# EAGLE design PiBladePsuInput (EAGLE 7.4.0)
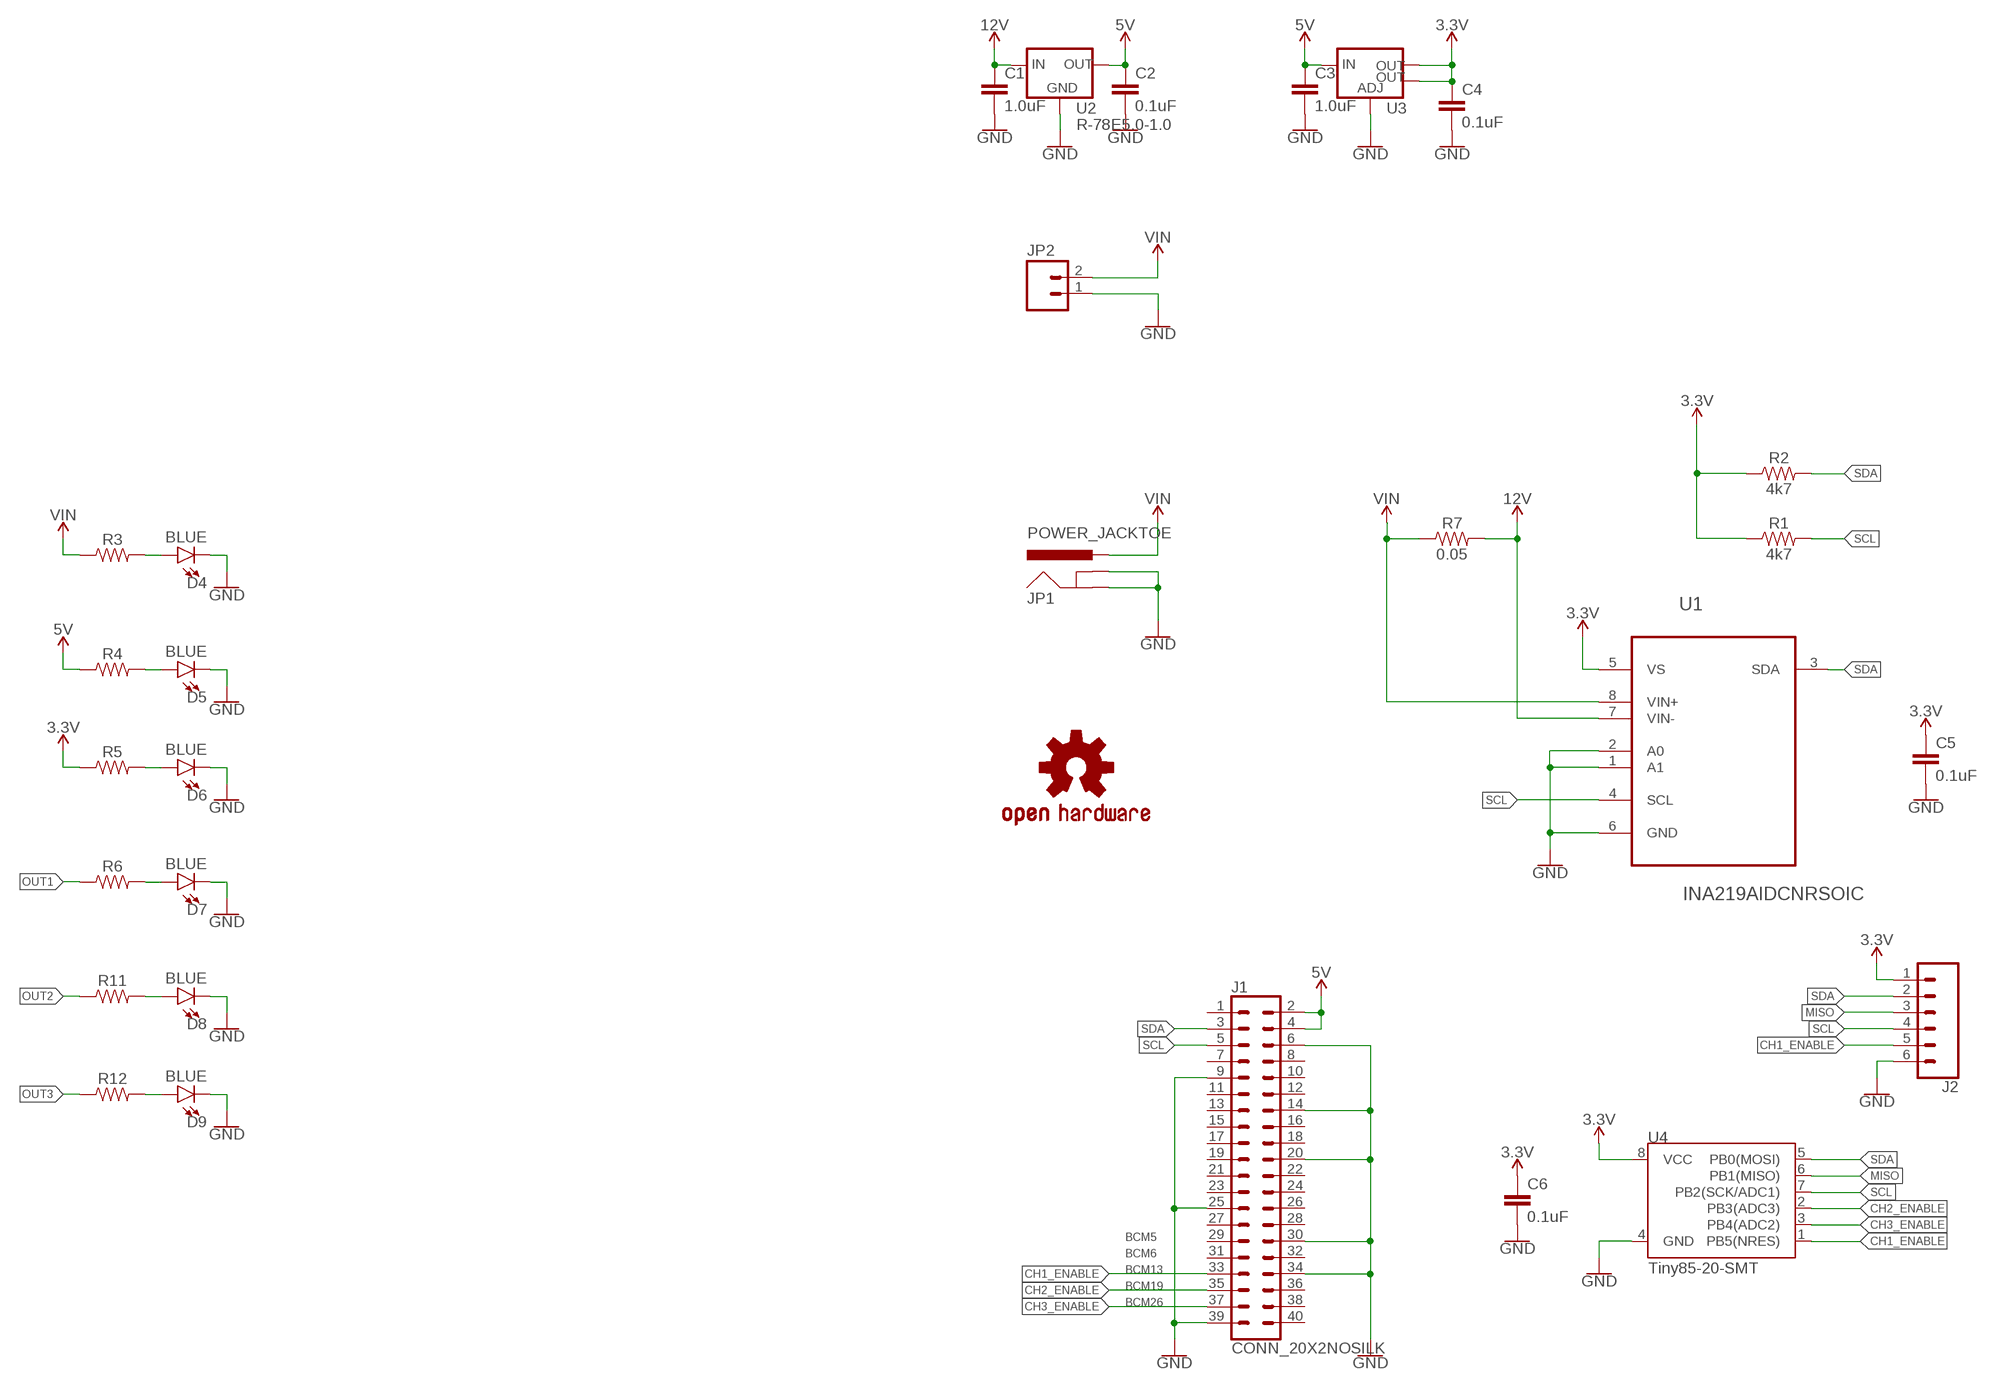
[diagram p0: schematic, sheet 1, part 1 of 2]
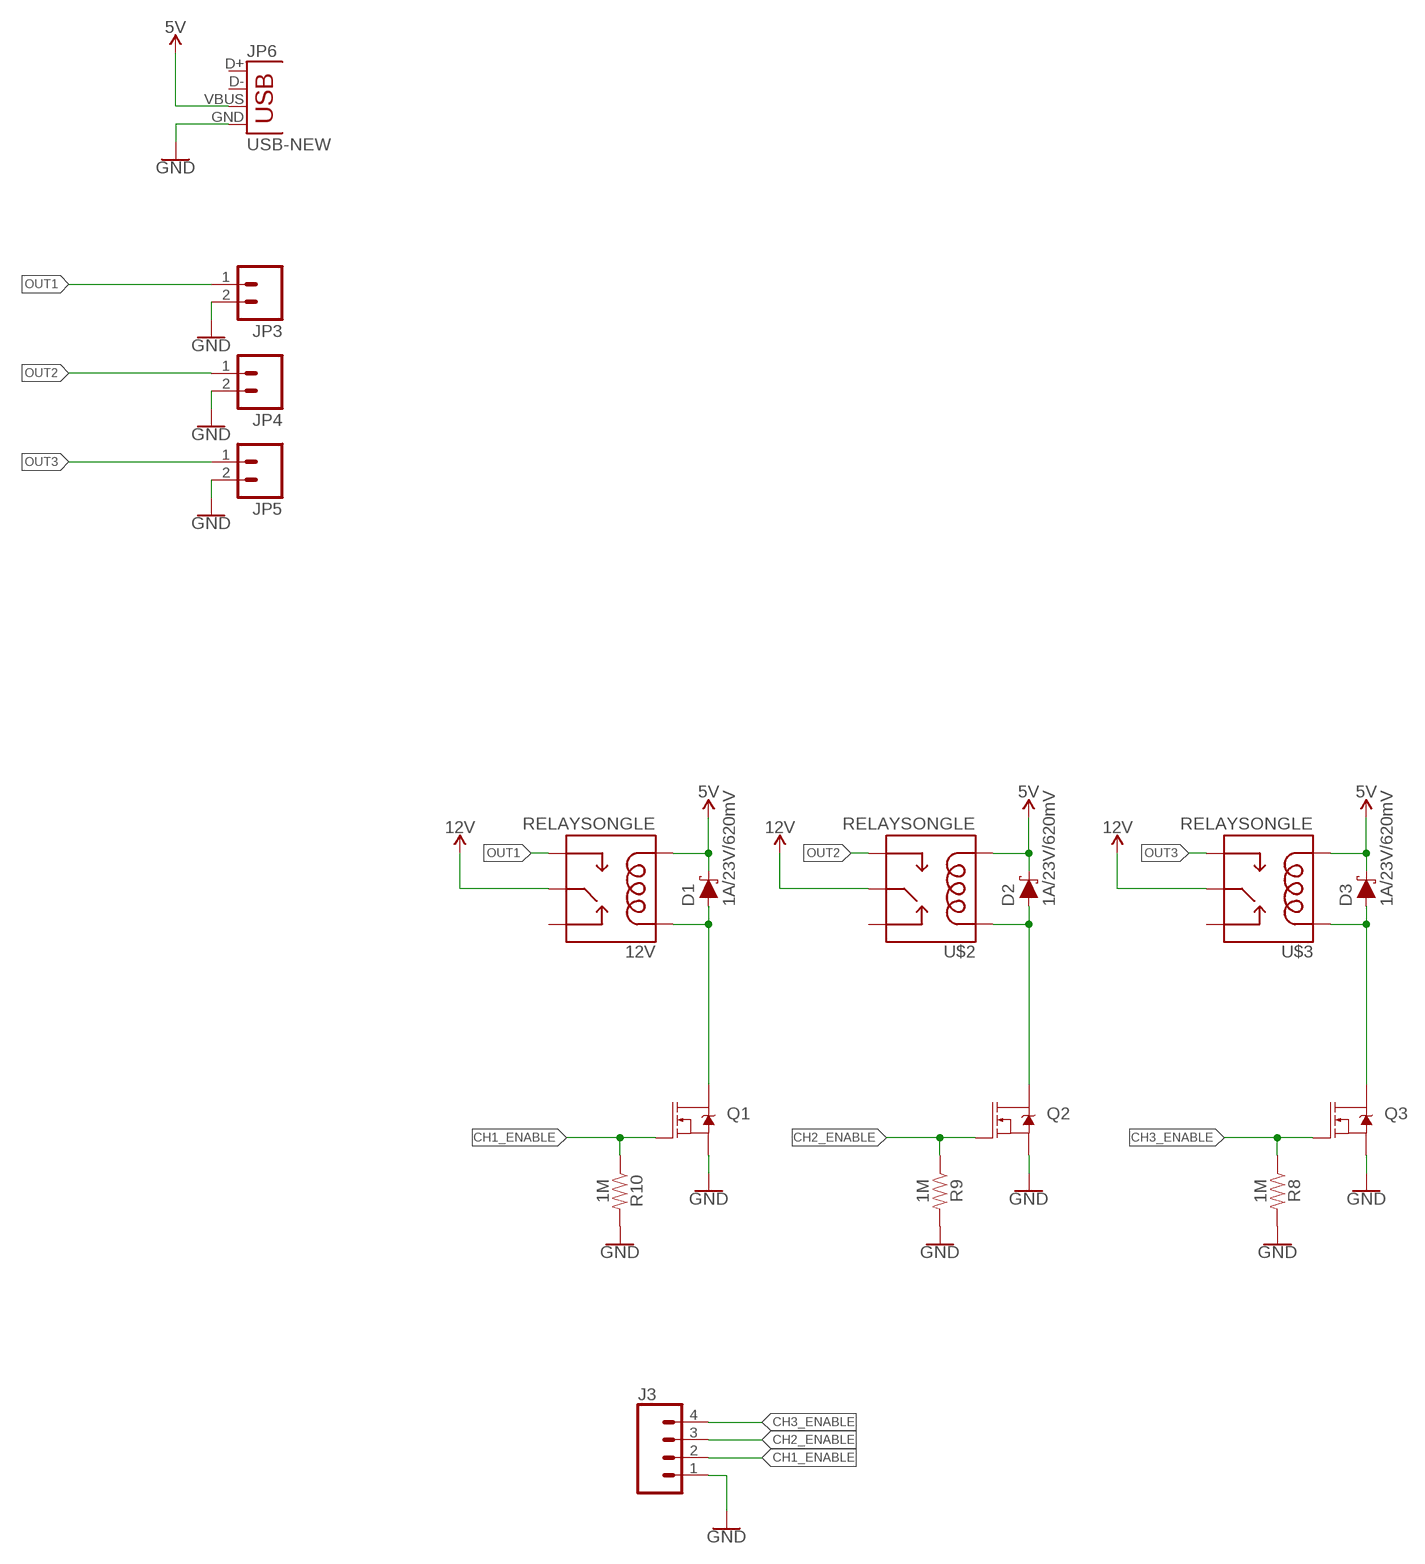
[diagram p1: schematic, sheet 1, part 2 of 2]

## Parts
12V  RELAYSONGLE  [SRD-5VDC-SL-C]
C1  1.0uF  1.0UF-0805-25V-(+80/-20%)  [0805]
C2  0.1uF  1.0UF-0805-25V-(+80/-20%)  [0805]
C3  1.0uF  1.0UF-0805-25V-(+80/-20%)  [0805]
C4  0.1uF  1.0UF-0805-25V-(+80/-20%)  [0805]
C5  0.1uF  1.0UF-0805-25V-(+80/-20%)  [0805]
C6  0.1uF  1.0UF-0805-25V-(+80/-20%)  [0805]
D1  1A/23V/620mV  DIODE-SCHOTTKY-BAT20J  [SOD-323]
D2  1A/23V/620mV  DIODE-SCHOTTKY-BAT20J  [SOD-323]
D3  1A/23V/620mV  DIODE-SCHOTTKY-BAT20J  [SOD-323]
D4  BLUE  LED-BLUE1206  [LED-1206]
D5  BLUE  LED-BLUE1206  [LED-1206]
D6  BLUE  LED-BLUE1206  [LED-1206]
D7  BLUE  LED-BLUE1206  [LED-1206]
D8  BLUE  LED-BLUE1206  [LED-1206]
D9  BLUE  LED-BLUE1206  [LED-1206]
J1  CONN_20X2NOSILK  [2X20_NOSILK]
J2  CONN_06SMD-1MM  [1X06-1MM]
J3  CONN_04SMD2  [1X04_1MM_RA]
JP1  POWER_JACKTOE  [POWER_JACK_SMD_OVERPASTE_TOE]
JP2  M025MM  [SCREWTERMINAL-5MM-2]
JP3  M025MM  [SCREWTERMINAL-5MM-2]
JP4  M025MM  [SCREWTERMINAL-5MM-2]
JP5  M025MM  [SCREWTERMINAL-5MM-2]
JP6  USB-NEW  [USB-A-VERTICAL]
LOGO1  OSHW-LOGOM  [OSHW-LOGO-M]
Q1  220mA/50V/3.5Ω  MOSFET-NCH-BSS138  [SOT23-3]
Q2  220mA/50V/3.5Ω  MOSFET-NCH-BSS138  [SOT23-3]
Q3  220mA/50V/3.5Ω  MOSFET-NCH-BSS138  [SOT23-3]
R1  4k7  RESISTOR0805  [0805]
R2  4k7  RESISTOR0805  [0805]
R3  RESISTOR0805  [0805]
R4  RESISTOR0805  [0805]
R5  RESISTOR0805  [0805]
R6  RESISTOR0805  [0805]
R7  0.05  0.05OHM-2512-3W-1%  [2512]
R8  1M  RESISTOR0805  [0805]
R9  1M  RESISTOR0805  [0805]
R10  1M  RESISTOR0805  [0805]
R11  RESISTOR0805  [0805]
R12  RESISTOR0805  [0805]
U1  INA219AIDCNRSOIC  [SO08]
U2  R-78E5.0-1.0  [DC-DC_CONVERTER_78XX]
U3  V_REG_LM1117SOT223  [SOT223]
U4  Tiny85-20-SMT  ATTINY45TINY85-20-SMT  [SO08-EIAJ]
U$2  RELAYSONGLE  [SRD-5VDC-SL-C]
U$3  RELAYSONGLE  [SRD-5VDC-SL-C]

## Nets
3.3V: C4.1 C5.1 C6.1 J2.1 R1.1 R2.1 R5.1 U1.5(VS) U3.2(OUT) U3.4(OUT) U4.8(VCC)
5V: 12V.COIL2 C2.1 C3.1 D1.C D2.C D3.C J1.2 J1.4 JP6.VBUS R4.1 U2.VOUT(OUT) U3.3(IN) U$2.COIL2 U$3.COIL2
12V: 12V.COMMON(MAIN) C1.1 R7.P$2 U1.7(VIN-) U2.VIN(IN) U$2.COMMON(MAIN) U$3.COMMON(MAIN)
CH1_ENABLE: J1.33 J2.5 J3.2 Q1.1(G) R10.1 U4.1(PB5(NRES))
CH2_ENABLE: J1.35 J3.3 Q2.1(G) R9.1 U4.2(PB3(ADC3))
CH3_ENABLE: J1.37 J3.4 Q3.1(G) R8.1 U4.3(PB4(ADC2))
GND: C1.2 C2.2 C3.2 C4.2 C5.2 C6.2 D4.C D5.C D6.C D7.C D8.C D9.C J1.6 J1.9 J1.14 J1.20 J1.25 J1.30 J1.34 J1.39 J2.6 J3.1 JP1.GND(GNDBREAK) JP1.P$4(GND) JP2.1 JP3.2 JP4.2 JP5.2 JP6.GND Q1.2(S) Q2.2(S) Q3.2(S) R8.2 R9.2 R10.2 U1.1(A1) U1.2(A0) U1.6(GND) U2.GND U3.1(ADJ) U4.4(GND)
MISO: J2.3 U4.6(PB1(MISO))
N$1: D4.A R3.2
N$2: D6.A R5.2
N$3: D7.A R6.2
N$4: D5.A R4.2
N$5: D8.A R11.2
N$6: D9.A R12.2
N$14: D3.A Q3.3(D) U$3.COIL1
N$31: D2.A Q2.3(D) U$2.COIL1
N$32: 12V.COIL1 D1.A Q1.3(D)
OUT1: 12V.OPEN(NO) JP3.1 R6.1
OUT2: JP4.1 R11.1 U$2.OPEN(NO)
OUT3: JP5.1 R12.1 U$3.OPEN(NO)
SCL: J1.5 J2.4 R1.2 U1.4(SCL) U4.7(PB2(SCK/ADC1))
SDA: J1.3 J2.2 R2.2 U1.3(SDA) U4.5(PB0(MOSI))
VIN: JP1.VIN0(PWR) JP2.2 R3.1 R7.P$1 U1.8(VIN+)
Unconnected: 12V.CLOSED(NC) J1.1 J1.7 J1.8 J1.10 J1.11 J1.12 J1.13 J1.15 J1.16 J1.17 J1.18 J1.19 J1.21 J1.22 J1.23 J1.24 J1.26 J1.27 J1.28 J1.29 J1.31 J1.32 J1.36 J1.38 J1.40 JP6.D+ JP6.D- U$2.CLOSED(NC) U$3.CLOSED(NC)

## Notes on the sheet
- BCM5
- BCM6
- BCM13
- BCM19
- BCM26

## Library data of the parts
12V U$2 U$3 = ThingySticks:RELAY: SPDT relay (COM-00101)
C1 C3 = SparkFun-Capacitors:1.0UF: 1µF ceramic capacitors A capacitor is a passive two-terminal electrical component used to store electrical energy temporarily in an electric field.; PROD_ID: CAP-11625
C2 C4-C6 = SparkFun-Capacitors:1.0UF: 1µF ceramic capacitors A capacitor is a passive two-terminal electrical component used to store electrical energy temporarily in an electric field.; PROD_ID: CAP-11625; VALUE: 1.0uF
D1-D3 = SparkFun-DiscreteSemi:DIODE-SCHOTTKY: Schottky diode A Schottky diode is a semiconductor diode which has a low forward voltage drop and a very fast switching action.; PROD_ID: DIO-11623
D4-D9 = SparkFun-LED:LED-BLUE: Blue SMD LED Used in manufacturing of various products at SparkFun Packages: 0603 - SMD 0603 package [Product Link] <http://www.digikey.com/product-detail/en/SMLE12BC7TT86/511-1589-2-ND/1641808> 1206 - SMD1206 package [Product Link] <http://www.digikey.com/product-detail/en/lite-on-inc/LTST-C150TBKT/160-1643-1-ND/573584> SparkFun Products: ESP8266 Thing-Dev Board <https://www.sparkfun.com/products/13711> RedBoard <https://www.sparkfun.com/products/12757>; PROD_ID: DIO-09911
J1 = SparkFun-Connectors:CONN_20X2: Multi connection point. Often used as Generic Header-pin footprint for 0.1 inch spaced/style header connections On any of the 0.1 inch spaced packages, you can populate with these: Break Away Headers - Straight <https://www.sparkfun.com/products/116> (PRT-00116) Break Away Male Headers - Right Angle <https://www.sparkfun.com/products/553> (PRT-00553) Female Headers <https://www.sparkfun.com/products/115> (PRT-00115) Break Away Headers - Machine Pin <https://www.sparkfun.com/products/117> (PRT-00117) Break Away Female Headers - Swiss Machine Pin <https://www.sparkfun.com/products/743> (PRT-00743)
J2 = SparkFun-Connectors:CONN_06: Multi connection point. Often used as Generic Header-pin footprint for 0.1 inch spaced/style header connections On any of the 0.1 inch spaced packages, you can populate with these: Break Away Headers - Straight <https://www.sparkfun.com/products/116> (PRT-00116) Break Away Male Headers - Right Angle <https://www.sparkfun.com/products/553> (PRT-00553) Female Headers <https://www.sparkfun.com/products/115> (PRT-00115) Break Away Headers - Machine Pin <https://www.sparkfun.com/products/117> (PRT-00117) Break Away Female Headers - Swiss Machine Pin <https://www.sparkfun.com/products/743> (PRT-00743) Arduino Stackable Header - 6 Pin <https://www.sparkfun.com/products/9280> (PRT-09280) For SCREWTERMINALS and SPRING TERMINALS visit here: Screw Terimnals on SparkFun.com <https://www.sparkfun.com/search/results?term=Screw+Terminals> (5mm/3.5mm/2.54mm spacing) This device is also useful as a general connection point to wire up your design to another part of your project. Our various solder wires solder well into these plated through hole pads. Hook-Up Wire - Assortment (Stranded, 22 AWG) <https://www.sparkfun.com/products/11375> (PRT-11375) Hook-Up Wire - Assortment (Solid Core, 22 AWG) <https://www.sparkfun.com/products/11367> (PRT-11367) View the entire wire category on our website here <https://www.sparkfun.com/categories/141>; PROD_ID: CONN-08249; SF_ID: GPS-00579
J3 = SparkFun-Connectors:CONN_04: Multi connection point. Often used as Generic Header-pin footprint for 0.1 inch spaced/style header connections On any of the 0.1 inch spaced packages, you can populate with these: Break Away Headers - Straight <https://www.sparkfun.com/products/116> (PRT-00116) Break Away Male Headers - Right Angle <https://www.sparkfun.com/products/553> (PRT-00553) Female Headers <https://www.sparkfun.com/products/115> (PRT-00115) Break Away Headers - Machine Pin <https://www.sparkfun.com/products/117> (PRT-00117) Break Away Female Headers - Swiss Machine Pin <https://www.sparkfun.com/products/743> (PRT-00743) For SCREWTERMINALS and SPRING TERMINALS visit here: Screw Terimnals on SparkFun.com <https://www.sparkfun.com/search/results?term=Screw+Terminals> (5mm/3.5mm/2.54mm spacing) This device is also useful as a general connection point to wire up your design to another part of your project. Our various solder wires solder well into these plated through hole pads. Hook-Up Wire - Assortment (Stranded, 22 AWG) <https://www.sparkfun.com/products/11375> (PRT-11375) Hook-Up Wire - Assortment (Solid Core, 22 AWG) <https://www.sparkfun.com/products/11367> (PRT-11367) View the entire wire category on our website here <https://www.sparkfun.com/categories/141> Special notes: Molex polarized connector foot print use with SKU : PRT-08231 with associated crimp pins and housings. 1MM SMD Version SKU: PRT-10208; PROD_ID: CONN-10310; SF_ID: PRT-10208
JP1 = SparkFun-Connectors:POWER_JACK: Power Jack Connector This is the standard 5.5mm barrel jack for power. The PTH is the most common, proven, reliable, footprint. The Slot footprint only works if the mill layer is transmitted to the PCB fab house so be warned. Here are the connectors we sell at SparkFun: DC Barrel Power Jack/Connector <https://www.sparkfun.com/products/119> (PRT-00119) DC Barrel Power Jack/Connector (SMD) <https://www.sparkfun.com/products/12748> (PRT-12748) DC Barrel Jack Adapter - Breadboard Compatible <https://www.sparkfun.com/products/10811> (PRT-10811) It is used on this SparkFun product (and many, many others): SparkFun RedBoard - Programmed with Arduino <https://www.sparkfun.com/products/12757> (DEV-12757) Also, if you need a mating power supply or connector, please check these out: Wall Adapter Power Supply - 9VDC 650mA <https://www.sparkfun.com/products/298> (TOL-00298) DC Barrel Jack Adapter - Male <https://www.sparkfun.com/products/10287> (PRT-10287); PROD_ID: CONN-08106; SF_ID: PRT-12748
JP2-JP5 = SparkFun-Connectors:M02: Standard 2-pin 0.1" header. Use with - straight break away headers ( PRT-00116) - right angle break away headers (PRT-00553) - swiss pins (PRT-00743) - machine pins (PRT-00117) - female headers (PRT-00115) Molex polarized connector foot print use with: PRT-08233 with associated crimp pins and housings. 2.54_SCREWTERM for use with PRT-10571. 3.5mm Screw Terminal footprints for PRT-08084 5mm Screw Terminal footprints for use with PRT-08432; STOREFRONT_ID: PRT-08432
JP6 = Tinamous:USB-NEW: USB Connectors USB-B-PTH is fully proven SKU : PRT-00139/CONN-08278 USB-miniB is fully proven SKU : PRT-00587 USB-A-PCB is untested. USB-A-H is throughly reviewed, but untested. Spark Fun Electronics SKU : PRT-00437 USB-B-SMT is throughly reviewed, but untested. Needs silkscreen touching up. USB-A-S has not been used/tested USB-MB-H has not been used/tested USB-MICROB has been used. CONN-09505
LOGO1 = Tinamous:OSHW-LOGO: Open Source Hardware Logo This logo indicates the piece of hardware it is found on incorporates a OSHW license and/or adheres to the definition of open source hardware found here: http://freedomdefined.org/OSHW
Q1-Q3 = SparkFun-DiscreteSemi:MOSFET-NCH: N-channel MOSFETs Voltage controlled devices that allow control of high current outputs. SparkFun Products: SparkFun OpenScale <https://www.sparkfun.com/products/13261> SparkFun Digital Sandbox <https://www.sparkfun.com/products/12651> SparkFun Monster Moto Shield <https://www.sparkfun.com/products/10182> SparkFun MOSFET Power Controller <https://www.sparkfun.com/products/11214>; PROD_ID: TRANS-00830
R1-R6 R8-R12 = SparkFun-Resistors:RESISTOR: Generic Resistor Package
R7 = SparkFun-Resistors:0.05OHM: 0.05Ω resistor A resistor is a passive two-terminal electrical component that implements electrical resistance as a circuit element. Resistors act to reduce current flow, and, at the same time, act to lower voltage levels within circuits. - Wikipedia; PROD_ID: RES-13771
U1 = INA219AIDCNR:INA219AIDCNR: CURRENT/POWER MONITOR
U2 = SparkFun-IC-Power:R-78E5.0-1.0: Recom Power 5V 1A DC/DC Converter The Recom R-78E5.0-X.X is a compact DC/DC converter module that is a pin for pin drop-in replacement for the LM7805 linear voltage regulator. Specifications: Input Range: 7-28V Output Voltage: 5V Output Current: 1A Max Efficiency: 91% Datasheet <https://www.recom-power.com/pdf/Innoline/R-78Exx-1.0.pdf>; PROD_ID: COM-13655
U3 = SparkFun-PowerIC:V_REG_LM1117: Voltage Regulator LM1117 Standard adjustable voltage regulator but in SMD form. Spark Fun Electronics SKU : COM-00595; PROD_ID: VREG-08170
U4 = SparkFun-DigitalIC:ATTINY45: Atmel 8-pin 2/4/8kB flash uC; PROD_ID: IC-09092

## Board
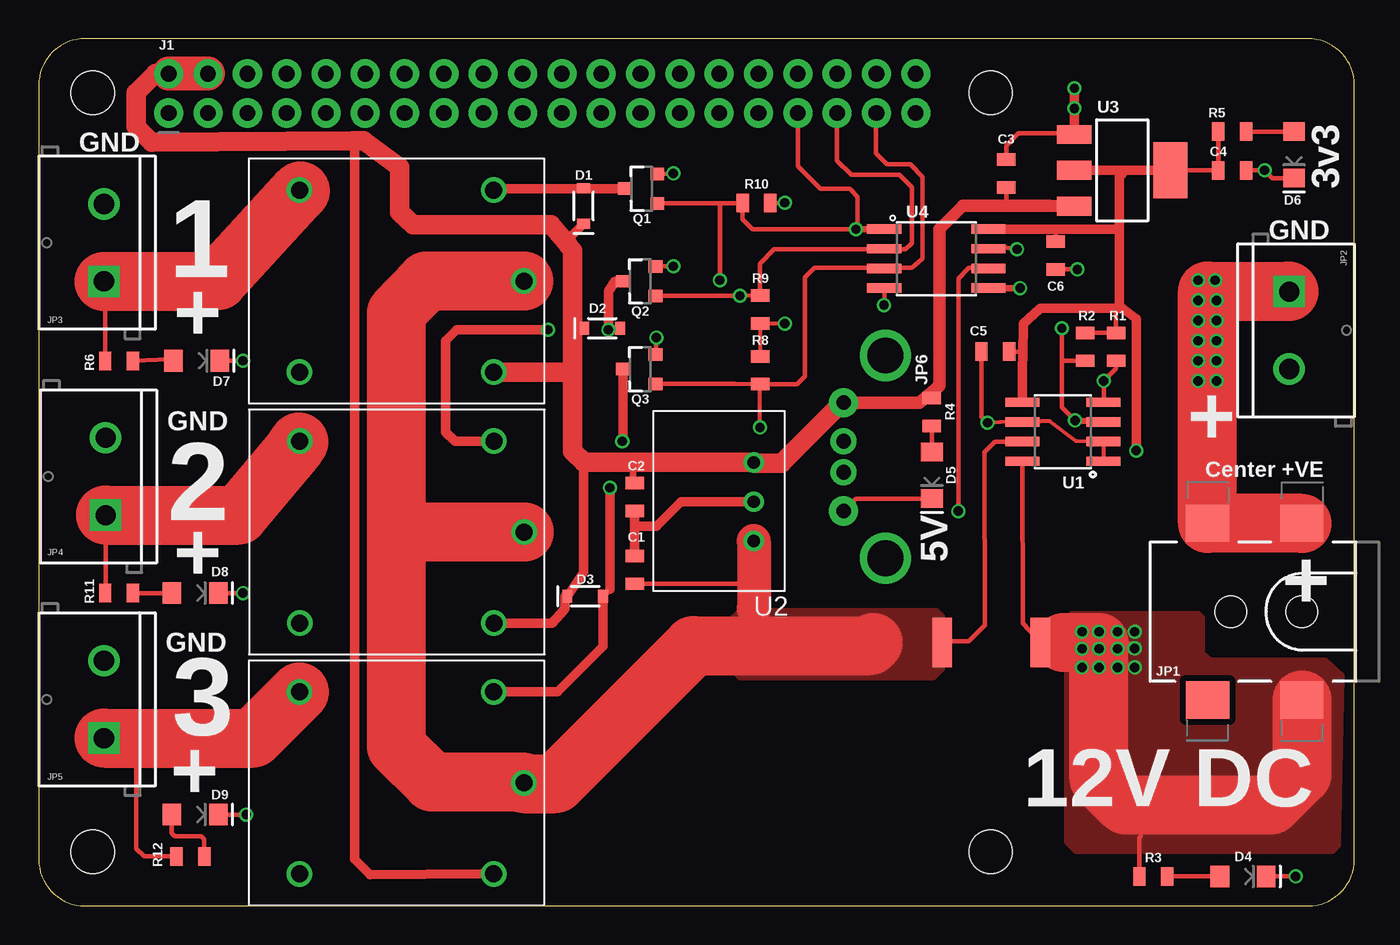
[diagram p2: board, top side]
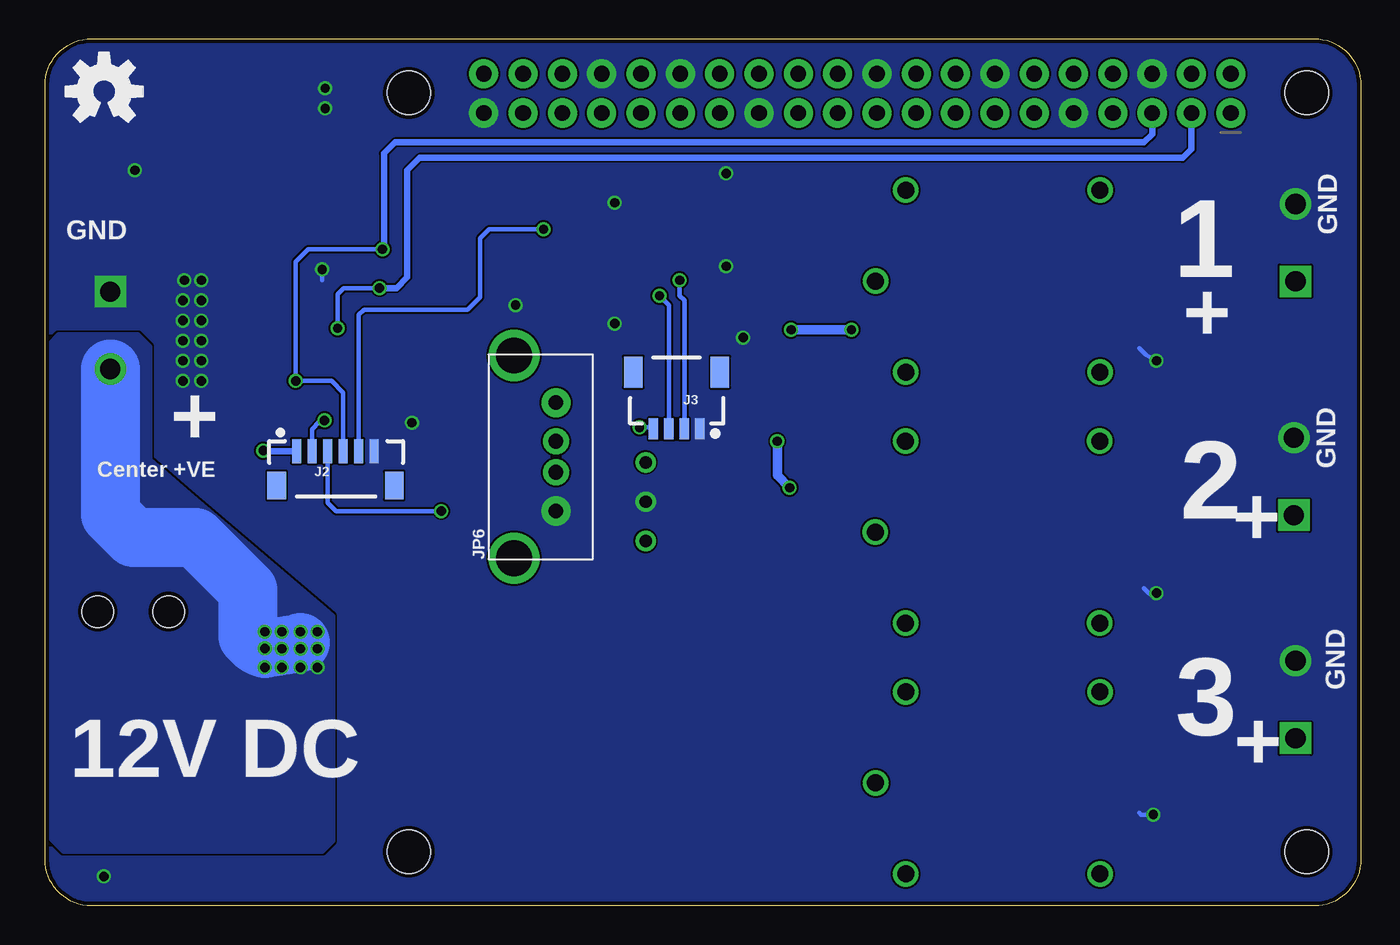
[diagram p3: board, bottom side, seen from below]

Size 85 x 56 mm. Coordinates in mm from the lower left corner, seen from the top.
Outline: 0,3 arc90 3,0 82,0 arc90 85,3 85,53 arc90 82,56 3,56 arc90 0,53 0,3
Copper layers (1*16): Top 0.035mm / dielectric 1.5mm / Bottom 0.035mm
Design rules "dirt_cheap_dirty_boards.v1": minimum track width 5mil, minimum drill 12mil, track to track 5mil, track to pad 5mil, pad to pad 5mil, via to via 5mil, smd to smd 0mil, copper to edge 10mil, drill to drill 10mil, minimum pad ring 10mil, minimum via ring 6mil, stop-mask expansion 2mil, vias tented up to drill 25mil, thermal gap 10mil
Holes 2.8 mm at 3.5,52.5 61.5,52.5 3.5,3.5 61.5,3.5

### Footprints (pad centres in the part's own frame; a part is rotated, then mirrored left to right if it is on the bottom)
SRD-5VDC-SL-C = drill 1.1: CLOSED -6.275,-5.875; COIL1 6.275,5.875; COIL2 6.275,-5.875; COMMON 8.225,0; OPEN -6.275,5.875
0805 = smd 0.8 x 1.2: 1 -0.9,0; 2 0.9,0
SOD-323 = smd 0.63 x 0.83: A 1.15,0; C -1.15,0
LED-1206 = smd 1.2 x 1.4: A -1.5,0; C 1.5,0
2X20_NOSILK = drill 1.016 pad 1.88: 1 0,0; 2 0,2.54; 3 2.54,0; 4 2.54,2.54; 5 5.08,0; 6 5.08,2.54; 7 7.62,0; 8 7.62,2.54; 9 10.16,0; 10 10.16,2.54; 11 12.7,0; 12 12.7,2.54; 13 15.24,0; 14 15.24,2.54; 15 17.78,0; 16 17.78,2.54; 17 20.32,0; 18 20.32,2.54; 19 22.86,0; 20 22.86,2.54; 21 25.4,0; 22 25.4,2.54; 23 27.94,0; 24 27.94,2.54; 25 30.48,0; 26 30.48,2.54; 27 33.02,0; 28 33.02,2.54; 29 35.56,0; 30 35.56,2.54; 31 38.1,0; 32 38.1,2.54; 33 40.64,0; 34 40.64,2.54; 35 43.18,0; 36 43.18,2.54; 37 45.72,0; 38 45.72,2.54; 39 48.26,0; 40 48.26,2.54
1X06-1MM = smd 0.6 x 1.55: 1 -2.54,1.27; 2 -1.54,1.27; 3 -0.54,1.27; 4 0.46,1.27; 5 1.46,1.27; 6 2.46,1.27 | smd 1.2 x 1.8: P$1 -3.84,-0.955; P$2 3.76,-0.955
1X04_1MM_RA = smd 0.6 x 1.35: 1 -1.5,0; 2 -0.5,0; 3 0.5,0; 4 1.5,0 | smd 1.2 x 2: NC1 2.8,-3.675; NC2 -2.8,-3.675
POWER_JACK_SMD_OVERPASTE_TOE = smd 2.8 x 2.4: GND 0,-5.7; P$4 6.1,-5.7; VIN0 0,5.7; VIN1 6.1,5.7 | hole 2.032: 0,0; 4.572,0
SCREWTERMINAL-5MM-2 = drill 1.3 pad 2.032 square: 1 0,0 | drill 1.3 pad 2.032: 2 5,0
USB-A-VERTICAL = drill 0.95 pad 1.676: D+ 2.7,1; D- 2.7,-1 | drill 0.95 pad 1.88: GND 2.7,3.5; VBUS 2.7,-3.5 | drill 2.3: SHLD1 0,-6.55; SHLD2 0,6.55
SOT23-3 = smd 0.8 x 0.9: 1 -0.95,-1; 2 0.95,-1; 3 0,1.1
2512 = smd 1.27 x 3.175: P$1 -3.175,0; P$2 3.175,0
SO08 = smd 0.61 x 2.21: 1 -1.905,-2.616; 2 -0.635,-2.616; 3 0.635,-2.616; 4 1.905,-2.616; 5 1.905,2.616; 6 0.635,2.616; 7 -0.635,2.616; 8 -1.905,2.616
DC-DC_CONVERTER_78XX = drill 0.8: GND 0,0; VIN -2.54,0; VOUT 2.54,0
SOT223 = smd 1.219 x 2.235: 1 -2.311,-3.099; 2 0,-3.099; 3 2.311,-3.099 | smd 3.6 x 2.2: 4 0,3.099
SO08-EIAJ = smd 0.61 x 2.21: 1 -1.905,-3.378; 2 -0.635,-3.378; 3 0.635,-3.378; 4 1.905,-3.378; 5 1.905,3.353; 6 0.635,3.353; 7 -0.635,3.353; 8 -1.905,3.353

### Placement (x,y rotation side)
12V  23.12,40.35 0 top
C1  38.5,21.7 90 top
C2  38.5,26.4 270 top
C3  62.5,47.3 90 top
C4  77.1,47.5 0 top
C5  61.8,35.8 180 top
C6  65.7,42 270 top
D1  35.2,45.2 90 top
D2  36.4,37.3 0 top
D3  35.3,20 0 top
D4  77.8,1.9 0 top
D5  57.7,27.8 270 top
D6  81.1,48.5 270 top
D7  10.2,35.2 0 top
D8  10.1,20.2 0 top
D9  10.1,5.9 0 top
J1  8.4,51.2 0 top
J2  66.2,28.1 0 bottom
J3  44.2,30.8 180 bottom
JP1  81.6,19 180 top
JP2  80.78,39.67 270 top
JP3  4.22,40.33 90 top
JP4  4.32,25.23 90 top
JP5  4.22,10.83 90 top
JP6  54.7,29 180 top
LOGO1  81.18,52.6 0 top
Q1  38.96,46.32 90 top
Q2  38.86,40.34 90 top
Q3  38.86,34.66 90 top
R1  69.6,36.1 270 top
R2  67.6,36.1 270 top
R3  72,1.9 0 top
R4  57.7,31.9 270 top
R5  77.1,50 0 top
R6  5.2,35.2 0 top
R7  61.54,17.01 180 top
R8  46.6,34.59 90 top
R9  46.6,38.52 270 top
R10  46.37,45.4 0 top
R11  5.2,20.2 0 top
R12  9.8,3.2 0 top
U1  66.16,30.62 90 top
U2  46.2,26.1 90 top
U3  70,47.5 270 top
U4  58,41.8 270 top
U$2  23.14,24.14 0 top
U$3  23.12,7.94 0 top

### Tracks (layer width: path | path; a pad name or v marks a point on that pad's centre or on a via)
3.3V  (via drill 0.6)
  Top 0.305: U3.4 C4.1 R5.1 | C5.1 63.57,35.8 63.58,35.79 | C6.1 65.7,43.6 65.8,43.7 | R2.1 R1.1 69.6,38.4 69.8,38.6
  Top 0.61: U1.5 63.56,34.54 63.58,35.79 63.6,37.4 63.6,37.6 64.7,38.6 69.8,38.6 | 69.8,38.6 70,38.6 70.9,37.9 v70.9,29.4 | U4.8 65.8,43.7 68.69,43.7 69.8,43.7 | 69.8,38.6 69.8,43.7 | 69.8,43.7 69.8,47.1 70.2,47.5 | 70.2,47.5 U3.4 | U3.2 70.2,47.5
  Bottom 0.406: J2.1 70.87,29.37 v70.9,29.4
5V
  Top 0.254: 29.42,34.5 12V.COIL2
  Top 0.305: C3.1 62.5,45.2 | 34.45,43.3 34.2,42.7 | D2.C 34.6,37.3 34.5,37.2 | R4.1 57.64,32.8 57.47,32.98 | 20.4,49.3 20.3,49.4
  Top 0.406: D3.C 34,20 | 12V.COIL2 | C2.1 38.4,27.4 38.4,28.64
  Top 0.61: U$2.COIL2 33.16,18.27 34,19.2 34,20 | D1.C 34.45,43.3 | D3.C 35.2,21.55 35.2,28.64 | U$3.COIL2 28.6,2.06 21.4,2 20.4,3 20.4,49.3
  Top 0.813: JP6.VBUS 56.9,32.5 57.47,32.98 58.2,33.6 58.2,43.7 59.7,45.2 62.5,45.2 65.29,45.2 U3.3
  Top 1.016: 46.24,28.6 U2.VOUT | 35.23,28.64 35.2,28.64
  Top 1.27: JP6.VBUS 51.9,32.5 48,28.6 46.24,28.6 | J1.2 7.54,53.74 6.3,52.5 6.3,50.3 7.3,49.3 20.3,49.4 21,49.4 23.3,47.7 23.3,44.8 24.2,44 33.1,44 34.2,42.7 34.5,42.3 34.5,37.2 34.5,34.5 | 34.5,34.5 34.5,29.37 35.23,28.64 | 12V.COIL2 34.48,34.48 34.5,34.5 | 35.2,28.64 38.4,28.64 U2.VOUT
  Top 2.184: J1.4 J1.2
  Bottom 0.305: 29.38,18.3 U$2.COIL2
12V
  Top 0.305: U1.7 61.78,29.98 61.1,29.3 61.12,18.11 60.1,17.1 58.45,17.1 R7.P$2 | C1.1 45.5,20.8 46.14,21.44 46.14,23.5 U2.VIN | 31.3,7.9 U$3.COMMON
  Top 1.016: 46.2,19.2 46.5,18.9 46.5,17.8 47.3,17 53.9,17 54.3,17 | 58.35,17 R7.P$2
  Top 2.184: U2.VIN 46.2,19.2
  Top 3.81: 12V.COMMON 25.05,40.35 23.1,38.3 23.1,24.3 | 23.1,24.3 23.1,10.3 25.4,8 31.29,8 U$3.COMMON | U$2.COMMON 23.26,24.14 23.1,24.3 | 31.3,7.9 33.4,7.9 42.3,16.8 53.7,16.8 53.9,17
  pour Top (no thermals): 58.4,18.6 58.4,18.7 58,19.1 45.3,19.1 44.5,18.3 44.5,15.5 45.3,14.7 57.8,14.7 58.4,15.3
CH1_ENABLE  (via drill 0.6)
  Top 0.305: Q1.1 44,45.37 | 44,45.37 45.34,45.37 R10.1 45.47,44.33 46.1,43.7 v52.8,43.7 52.9,43.8 52.9,45.8 52.4,46.3 50.5,46.3 49.04,47.76 J1.33 | v44,40.4 44,45.37
  Top 0.406: v52.8,43.7 U4.1
  Bottom 0.305: J3.2 43.7,39.1 44,39.4 v44,40.4 | v52.8,43.7 56.3,43.7 56.9,43.1 56.9,39.3 57.7,38.5 64.4,38.5 64.74,38.16 J2.5
CH2_ENABLE  (via drill 0.6)
  Top 0.305: Q2.1 v45.3,39.4 R9.1 46.58,41.48 47.5,42.4 54.59,42.4 U4.2 54.66,42.4 56,42.4 56.4,42.8 56.4,46.4 55.6,47.2 52.5,47.2 51.58,48.12 J1.35
  Bottom 0.305: J3.3 44.7,38.8 v45.3,39.4
CH3_ENABLE  (via drill 0.6)
  Top 0.254: v46.6,30.9 R8.1
  Top 0.305: Q3.1 44.98,33.71 R8.1 | U4.3 54.66,41.2 56.4,41.2 57.1,41.8 57.1,47.1 56.3,47.9 54.8,47.9 54.1,48.6 54.1,51.18 J1.37 | R8.1 49,33.7 49.5,34.2 49.5,40.6 50.1,41.2 54.59,41.2
  Top 0.406: 54.59,41.2 U4.3
  Bottom 0.305: v46.6,30.9 45.8,30.9 J3.4
GND  (via drill 0.6)
  Top 0.254: v61.3,31.2 62.1,31.24 U1.6 64.7,31.29 65.3,31.3 67.02,30.02 U1.2 U1.1 | R10.2 v48.2,45.4 | v48.2,37.6 48.18,37.62 R9.2 R8.2
  Top 0.305: Q1.2 40.87,47.27 v41,47.3 | Q2.2 41.09,41.29 v41,41.3 | Q3.2 39.89,36.31 v39.9,36.7 | U4.4 54.62,38.82 v54.6,38.8 | C3.2 62.5,49.1 63.3,49.9 66.81,49.9 U3.1 | C4.2 v79.2,47.5 79.7,47 D6.C | C5.2 60.9,31.6 v61.3,31.2 | C6.2 v67.1,41.1 | D4.C v81.2,1.9 | D5.C 52.8,26.3 JP6.GND | D7.C v13.2,35.2 | D9.C v13.4,5.9 | D8.C v13.2,20.2
  Top 0.61: 66.9,51.3 v66.9,52.8 | U3.1 66.9,51.3 | 66.9,51.3 v66.9,51.5 | C1.2 38.5,24.5 | 38.5,24.5 C2.2 | U2.GND 41.5,26.1 39.9,24.5 38.5,24.5
  Top 3.81: JP1.GND JP1.P$4 75.5,39.7 80.75,39.7 JP2.1
  Bottom 0.305: v67.1,41.1 67.1,40.4 | v13.2,35.2 13.9,35.6 14.3,36 | v13.4,5.9 14.2,5.9 14.3,6 | v13.2,20.2 13.7,20.2 14,20.5
  other vias: 74.9,33.9 74.9,35.2 74.9,36.5 74.9,37.8 74.9,39.1 74.9,40.4 76.1,33.9 76.1,35.2 76.1,36.5 76.1,37.8 76.1,39.1 76,40.4
  pour Bottom (rank 6, no thermals): 0,56 85,56 85,0 0,0
MISO  (via drill 0.6)
  Top 0.305: v59.4,25.5 59.4,40.5 60.1,41.2 61.32,41.2
  Top 0.406: 61.32,41.2 U4.6
  Bottom 0.305: J2.3 66.74,26.04 66.2,25.5 v59.4,25.5
N$1
  Top 0.305: D4.A R3.2
N$2
  Top 0.305: R5.2 D6.A
N$3
  Top 0.305: R6.2 8.5,35.3 D7.A
N$4
  Top 0.305: D5.A R4.2
N$5
  Top 0.305: R11.2 D8.A
N$6
  Top 0.305: R12.2 10.7,4.3 10.5,4.5 8.8,4.5 8.6,4.7 D9.A
N$14  (via drill 0.6)
  Top 0.254: D3.A 36.45,19.75
  Top 0.305: 37.76,30.06 v37.7,30
  Top 0.406: 36.9,20.45 D3.A
  Top 0.61: U$3.COIL1 33.52,13.81 36.45,16.75 36.45,19.75 | Q3.3 37.76,30.06 | v36.9,27 36.9,20.45
  Bottom 0.61: v37.7,30 37.7,27.8 v36.9,27
N$31  (via drill 0.6)
  Top 0.305: 37.72,40.3 Q2.3 | 37.45,37.2 D2.A
  Top 0.406: 37.24,40.34 Q2.3 | v36.8,37.2 37.45,37.2
  Top 0.61: v36.8,37.2 36.8,39.7 37.24,40.34 | U$2.COIL1 26.89,30.02 26.3,30.6 26.3,36.5 27,37.2 v32.9,37.2
  Bottom 0.61: v32.9,37.2 v36.8,37.2
N$32
  Top 0.254: D1.A 35.23,46.25 35.3,46.32
  Top 0.61: Q1.3 35.3,46.32 29.49,46.32 12V.COIL1
OUT1
  Top 0.305: R6.1 4.3,40.25 JP3.1
  Top 2.54: 16.9,46.17 12V.OPEN
  Top 3.81: JP3.1 10.63,40.33 11.6,40.4 16.9,46.17
OUT2
  Top 0.305: JP4.1 4.32,20.22 R11.1
  Top 2.54: 16.8,29.95 U$2.OPEN
  Top 3.81: JP4.1 12.93,25.23 16.5,29.5 16.8,29.95
OUT3
  Top 0.305: R12.1 6.8,3.2 6.3,3.7 6.3,10 6.2,10.1 4.95,10.1 JP5.1
  Top 3.81: JP5.1 13.86,10.83 U$3.OPEN
SCL  (via drill 0.6)
  Top 0.305: U4.7 62.37,42.53 v63.2,42.4 | U1.4 68.8,32.55 v68.8,33.9 69.6,34.7 R1.2
  Bottom 0.305: v63.2,42.4 68,42.4 68.8,41.6 v68.8,33.9 66.5,33.9 65.74,33.14 J2.4
  Bottom 0.406: J1.5 13.48,49.82 14,49.3 62.4,49.3 63.1,48.6 63.1,42.69 63.15,42.44 63.16,42.44 v63.2,42.4
SDA  (via drill 0.6)
  Top 0.305: U1.3 67.05,31.25 | 66.1,35.2 66.1,32.2 v66.95,31.35 68.68,31.35 | 66.1,35.2 v66.1,37.3 | R2.2 66.1,35.2
  Top 0.406: v63.4,39.9 61.56,39.9 U4.5 | 67.05,31.25 v66.95,31.35 | 68.68,31.35 U1.3
  Bottom 0.305: v66.1,37.3 66.1,39.5 65.7,39.9 v63.4,39.9 | J2.2 67.74,30.8 67.3,31.25 67.05,31.25
  Bottom 0.406: J1.3 10.94,48.86 11.5,48.3 60.8,48.3 61.6,47.5 61.6,40.6 62.3,39.9 v63.4,39.9 63.7,39.9 | 67.05,31.25 v66.95,31.35
VIN  (via drill 0.6)
  Top 0.305: U1.8 63.59,18.24 R7.P$1 | R3.1 71.1,4.4 71.2,4.5
  Top 0.406: v67.4,17.7 v68.5,17.7 | v68.5,17.7 68.5,17 | v68.5,16.6 v69.7,16.6 69.6,16.2 70.2,15.6 | 69.1,15.6 68.5,15.6 | v68.5,16.6 68.5,16.8 68.3,17.6 69.97,17.2 v70.8,16.62 | v68.5,17.7 v69.7,17.7 | v67.4,16.6 v68.5,16.6
  Top 1.27: 66.2,17 R7.P$1
  Top 3.81: 66.2,17 68.5,17 v68.5,16.6 68.5,15.6 68.5,8.2 70.2,6.5 79.6,6.5 81.6,8.5 JP1.VIN0
  Bottom 0.406: v70.8,16.62 70.98,17.02 71,16.7
  Bottom 3.81: JP2.2 80.78,25.28 79.3,23.8 75.3,23.8 71.9,20.4 71.9,17.4 71.4,16.9 71,16.7 70.8,16.9 v70.8,16.62 68.5,17
  other vias: 67.4,15.4 68.5,15.4 69.7,15.4 70.8,15.4 70.8,17.7
  pour Top (isolate 0.406, no thermals): 66.7,18.9 74.9,18.9 75.2,18.6 75.2,16.3 75.7,15.9 83.1,15.9 84.2,14.9 84,3.9 83.6,3.5 67,3.5 66.4,4.1 66.4,18.6
  pour Bottom: 84.1,36.9 84.8,36.2 84.8,4.5 83.8,3.5 67.1,3.5 66.4,4.2 66.4,18.7 66.7,19 75.7,26.6 78.2,28.8 78.2,36.1 79,36.9

### Text on the board
tNames: GND | 3v3 | GND | 1 | + | GND | + | Center +VE | 2 | 5V | + | + | GND | 3 | + | 12V DC
bNames: GND | GND | 1 | + | GND | + | Center +VE | 2 | + | GND | 3 | + | 12V DC